# EAGLE design SoundMaker (EAGLE 7.3.0)
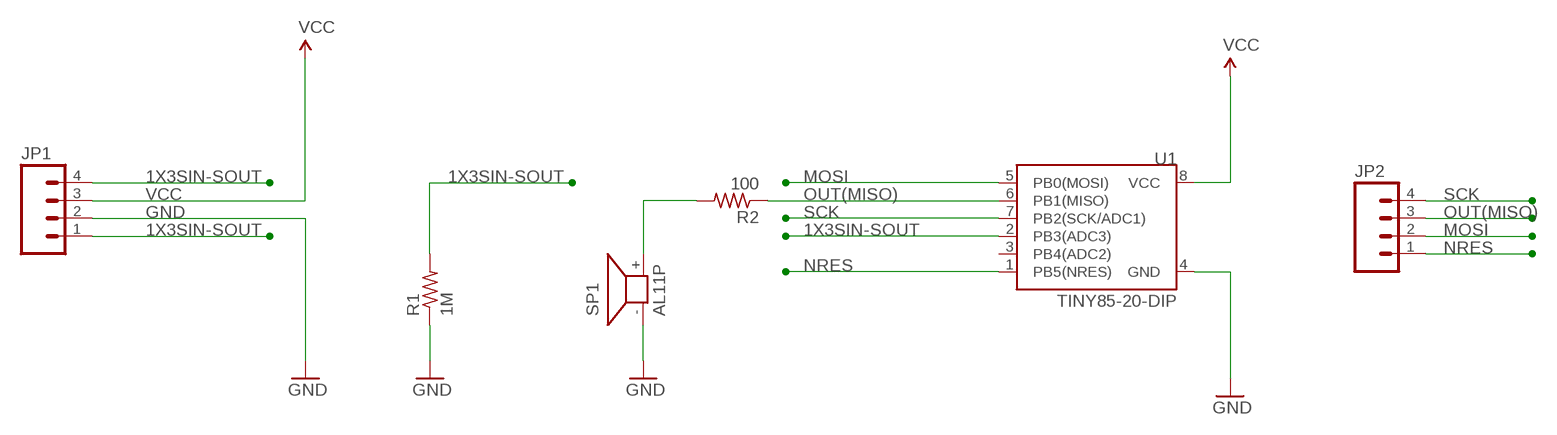
[diagram p0: schematic, sheet 1]

## Parts
JP1  M04PTH  [1X04]
JP2  M04PTH  [1X04]
R1  1M  R-US_R0603  [R0603]
R2  100  R-US_R0603  [R0603]
SP1  AL11P  [AL11P]
U1  TINY85-20-DIP  ATTINY45TINY85-20-DIP  [DIP08]

## Nets
1X3SIN-SOUT: JP1.1 JP1.4 R1.2 U1.2(PB3(ADC3))
CUR-LIMIT-OUT: R2.2 SP1.+
GND: JP1.2 R1.1 SP1.- U1.4(GND)
MOSI: JP2.2 U1.5(PB0(MOSI))
NRES: JP2.1 U1.1(PB5(NRES))
OUT(MISO): JP2.3 R2.1 U1.6(PB1(MISO))
SCK: JP2.4 U1.7(PB2(SCK/ADC1))
VCC: JP1.3 U1.8(VCC)
Unconnected: U1.3(PB4(ADC2))

## Library data of the parts
JP1 JP2 = SparkFun-Connectors:M04: Header 4 Standard 4-pin 0.1" header. Use with straight break away headers (SKU : PRT-00116), right angle break away headers (PRT-00553), swiss pins (PRT-00743), machine pins (PRT-00117), and female headers (PRT-00115). Molex polarized connector foot print use with SKU : PRT-08231 with associated crimp pins and housings. 1MM SMD Version SKU: PRT-10208
R1 R2 = adafruit:R-US_: RESISTOR, American symbol
SP1 = buzzer:AL11P: SPEAKER Source: Buerklin; OC_FARNELL: unknown; OC_NEWARK: unknown
U1 = SparkFun-DigitalIC:ATTINY45: Atmel 8-pin 2/4/8kB flash uC; PROD_ID: IC-09445

## Board
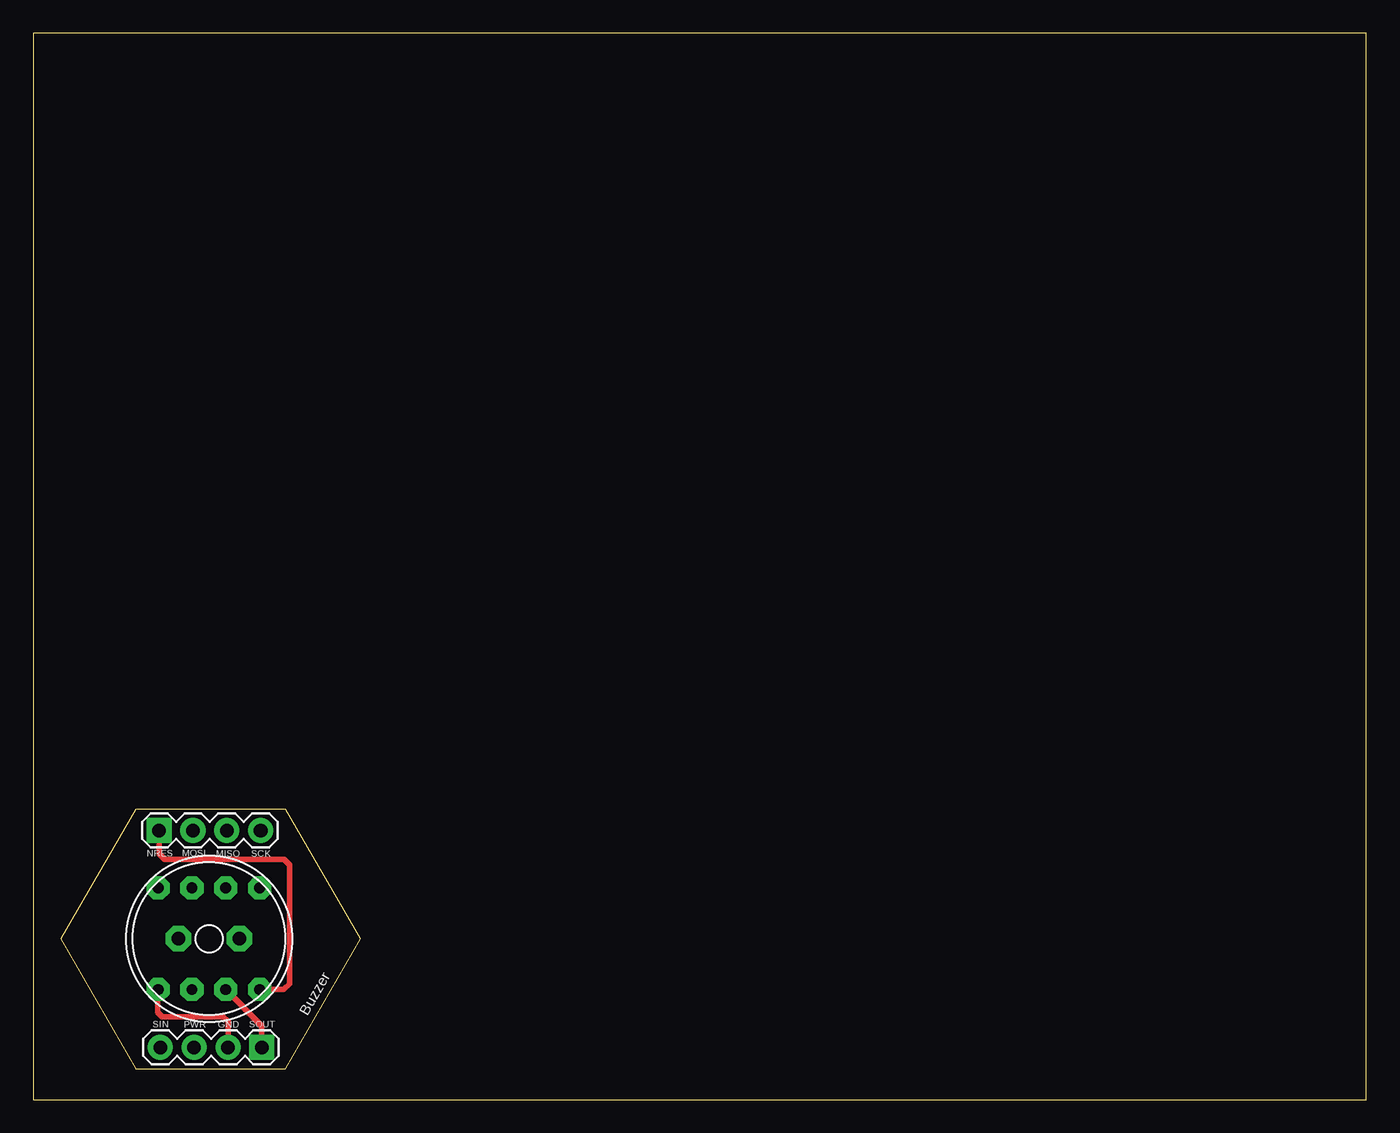
[diagram p1: board, top side]
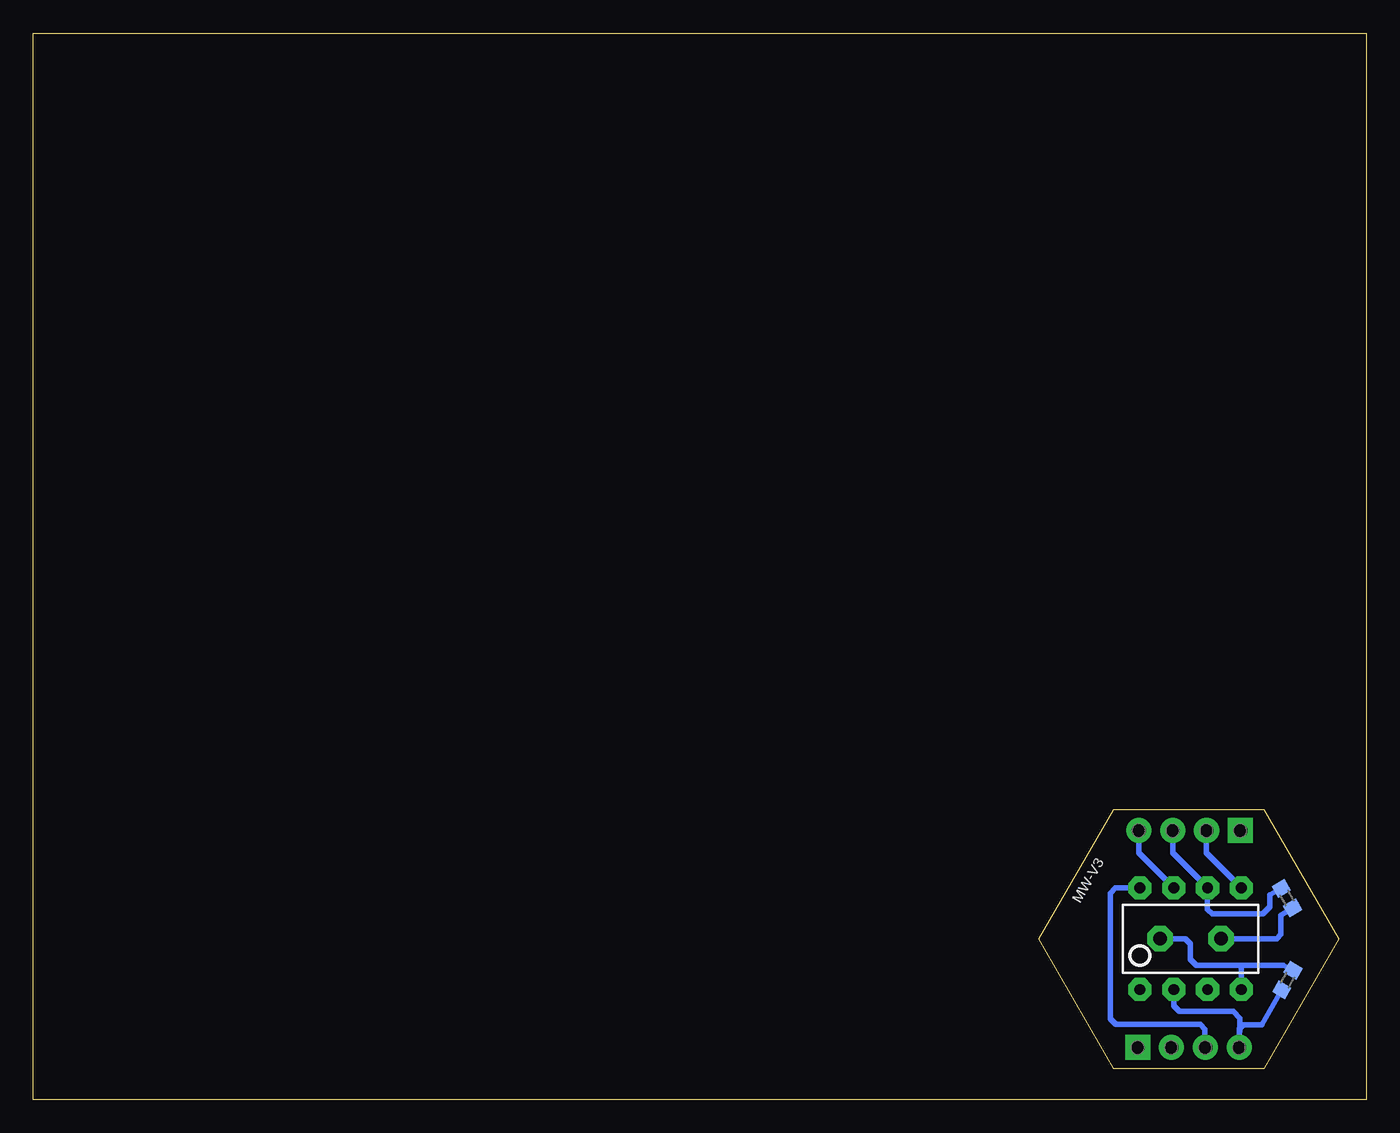
[diagram p2: board, bottom side, seen from below]

Size 100 x 80 mm. Coordinates in mm from the lower left corner, seen from the top.
Outline: 0,0 100,0 100,80 0,80 0,0
Outline: 7.69,2.3 18.94,2.3 24.56,12.04 18.94,21.78 7.69,21.78 2.06,12.04 7.69,2.3
Copper layers (1*16): Top 0.035mm / dielectric 1.5mm / Bottom 0.035mm
Design rules "default *": minimum track width 10mil, minimum drill 24mil, track to track 8mil, track to pad 8mil, pad to pad 8mil, via to via 8mil, smd to smd 8mil, copper to edge 0mil, drill to drill 8mil, minimum pad ring 10mil, minimum via ring 8mil, stop-mask expansion 4mil, vias tented up to drill 0mil, thermal gap 10mil

### Footprints (pad centres in the part's own frame; a part is rotated, then mirrored left to right if it is on the bottom)
1X04 = drill 1.016 pad 1.88 square: 1 0,0 | drill 1.016 pad 1.88: 2 2.54,0; 3 5.08,0; 4 7.62,0
R0603 = smd 1 x 1.1: 1 -0.85,0; 2 0.85,0
AL11P = drill 1.016 pad 1.905 octagon: + 2.286,0; - -2.286,0
DIP08 = drill 0.813 pad 1.727 octagon: 1 -3.81,-3.81; 2 -1.27,-3.81; 3 1.27,-3.81; 4 3.81,-3.81; 5 3.81,3.81; 6 1.27,3.81; 7 -1.27,3.81; 8 -3.81,3.81

### Placement (x,y rotation side)
JP1  17.14,3.91 180 top
JP2  9.44,20.18 0 top
R1  5.91,8.97 240 bottom
R2  5.94,15.11 300 bottom
SP1  13.18,12.06 180 top
U1  13.17,12.06 0 bottom

### Tracks (layer width: path | path; a pad name or v marks a point on that pad's centre or on a via)
1X3SIN-SOUT
  Top 0.4: JP1.1 17.14,5.55 U1.2
  Bottom 0.4: R1.2 7.84,5.61 9.21,5.61 9.51,5.31 9.51,5.09 | 9.51,5.09 9.51,3.92 JP1.4 | U1.2 14.44,7.02 14.02,6.6 9.98,6.6 9.49,6.11 9.49,5.12 9.51,5.09
CUR-LIMIT-OUT
  Bottom 0.4: R2.2 6.4,13.83 6.4,12.38 6.72,12.06 SP1.+
GND
  Top 0.4: JP1.2 14.61,5.88 14.26,6.22 9.66,6.22 9.35,6.54 9.35,8.24 U1.4
  Bottom 0.4: SP1.- 13.58,12.06 13.18,11.67 13.18,10.52 12.75,10.08 9.36,10.08 | 9.36,10.08 6.24,10.08 R1.1 | U1.4 9.36,10.08
MOSI
  Bottom 0.4: JP2.2 11.98,18.49 U1.5
NRES
  Top 0.4: U1.1 18.78,8.26 19.21,8.69 19.21,17.6 18.81,18.01 9.87,18.01 9.46,18.41 9.46,20.16 JP2.1
OUT(MISO)
  Bottom 0.4: JP2.3 14.52,18.49 U1.6 11.91,15.86 11.91,14.29 11.54,13.92 7.76,13.92 7.23,14.45 7.23,15.34 R2.1
SCK
  Bottom 0.4: JP2.4 17.06,18.49 U1.7
VCC
  Bottom 0.4: U1.8 18.81,15.88 19.2,15.48 19.2,6.06 18.78,5.64 12.46,5.64 12.09,5.27 12.09,3.94 JP1.3

### Text on the board
tPlace: NRES | MOSI | MISO | SCK | Buzzer | SIN | PWR | GND | SOUT
bPlace: MW-V3